# EAGLE board TGBD (EAGLE 9.6.2), part 1 of 2
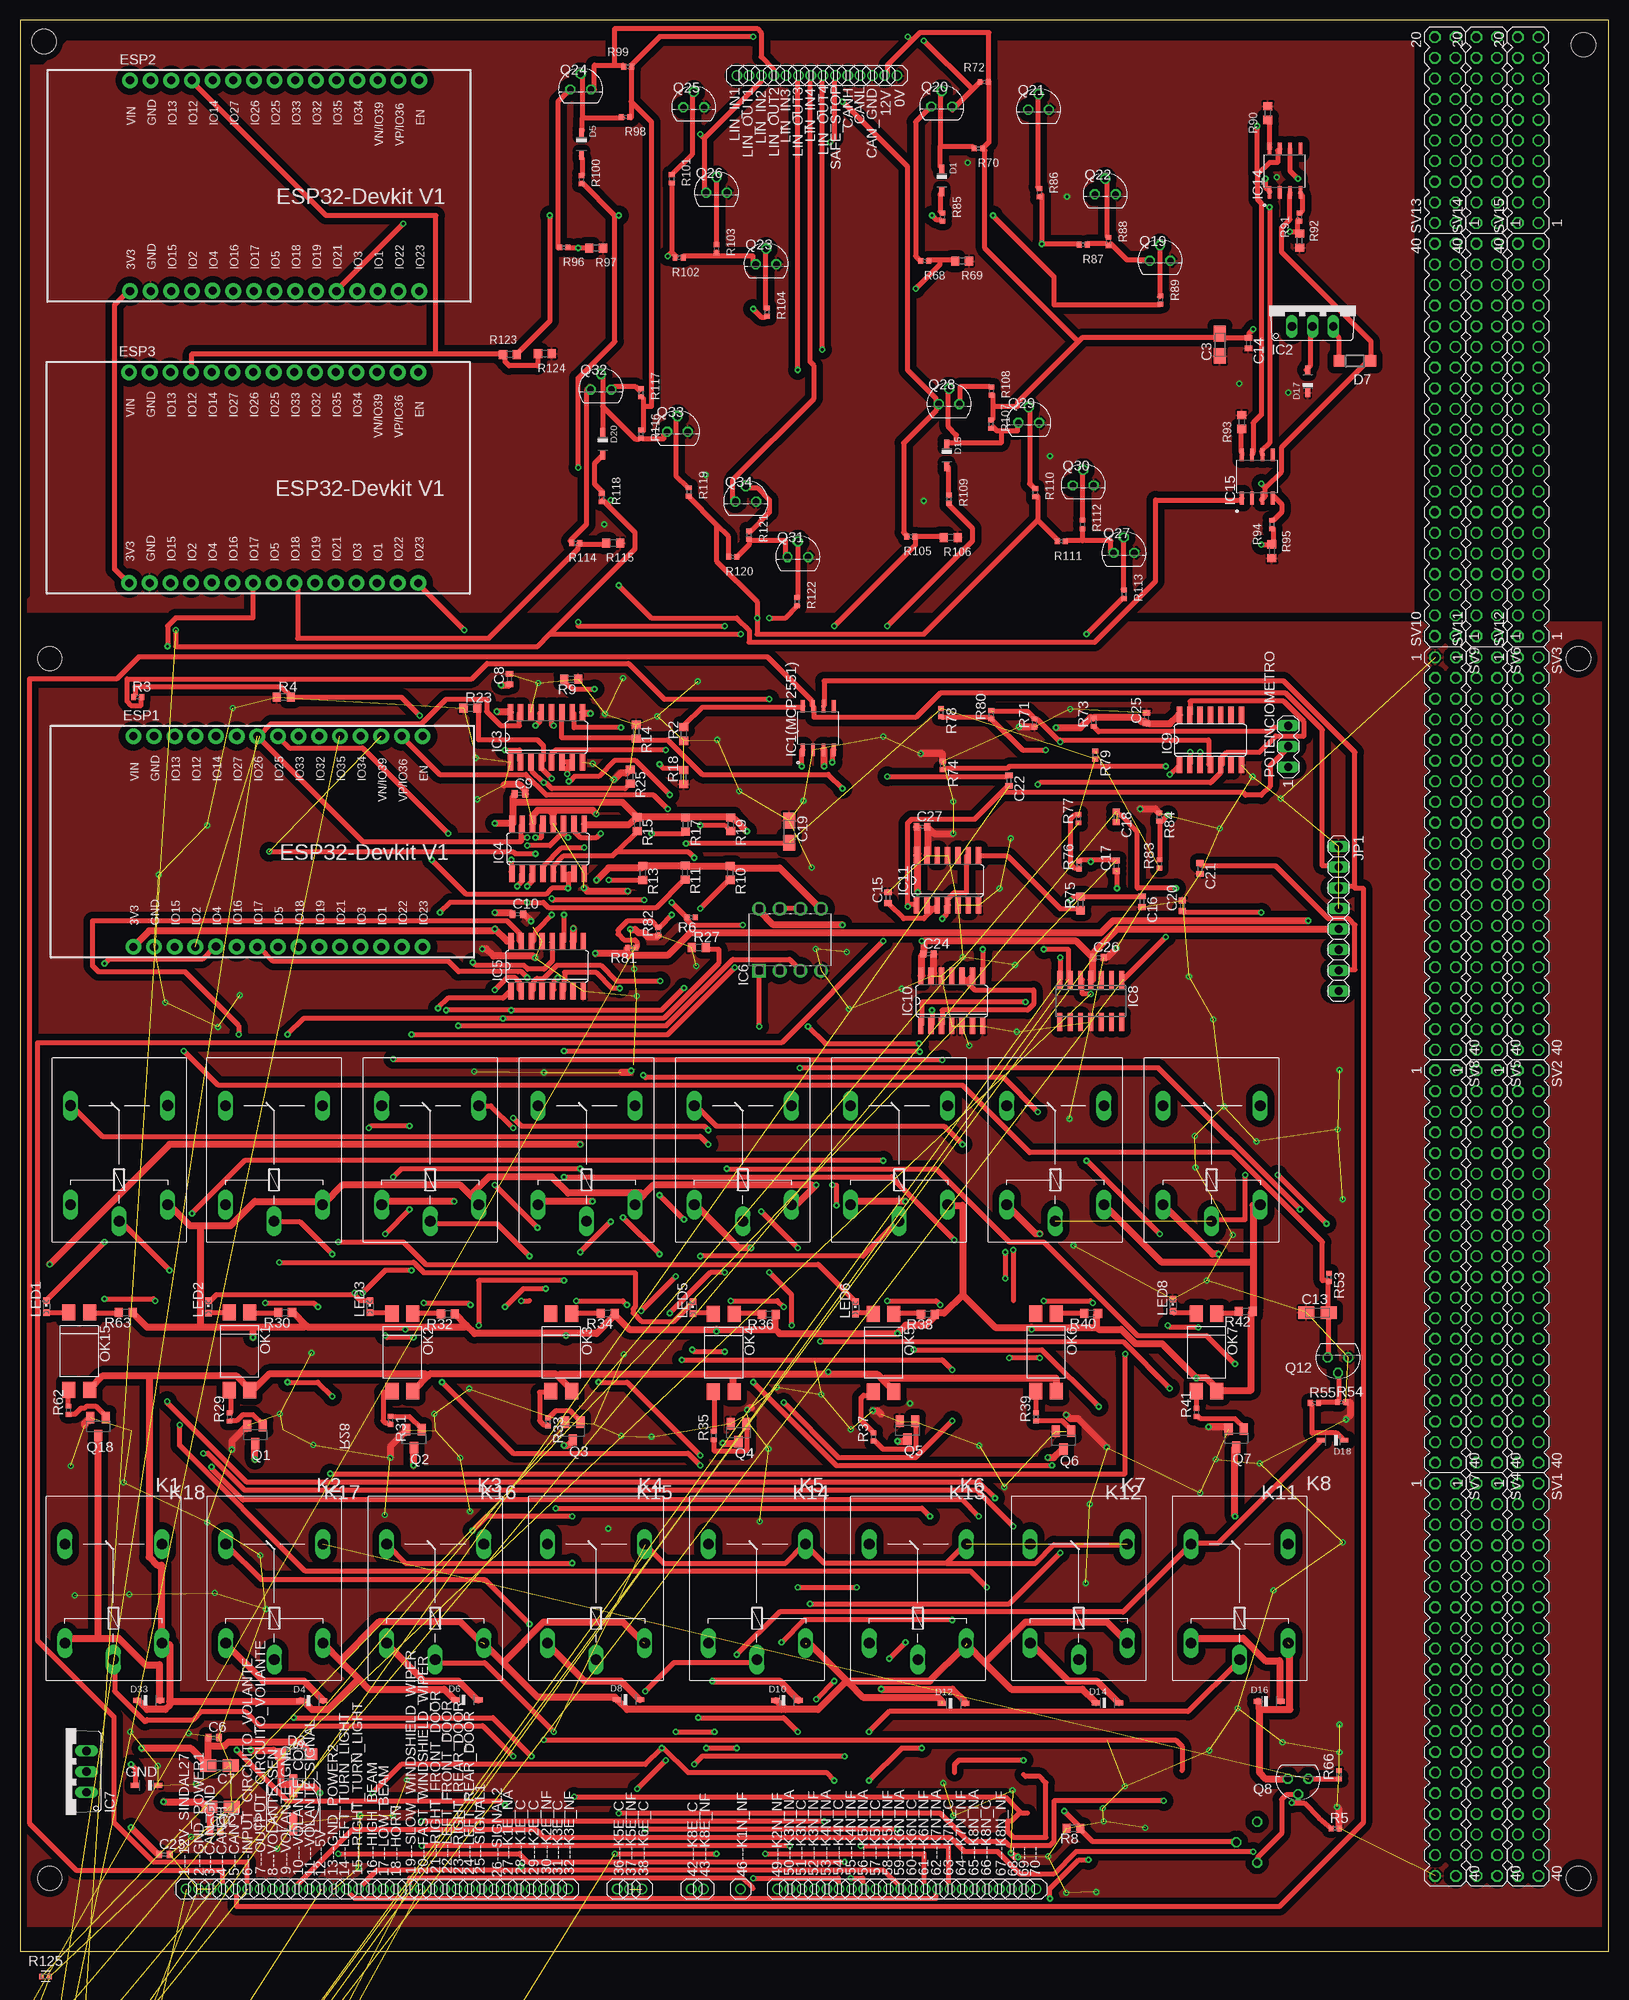
[diagram p5: board, top side]
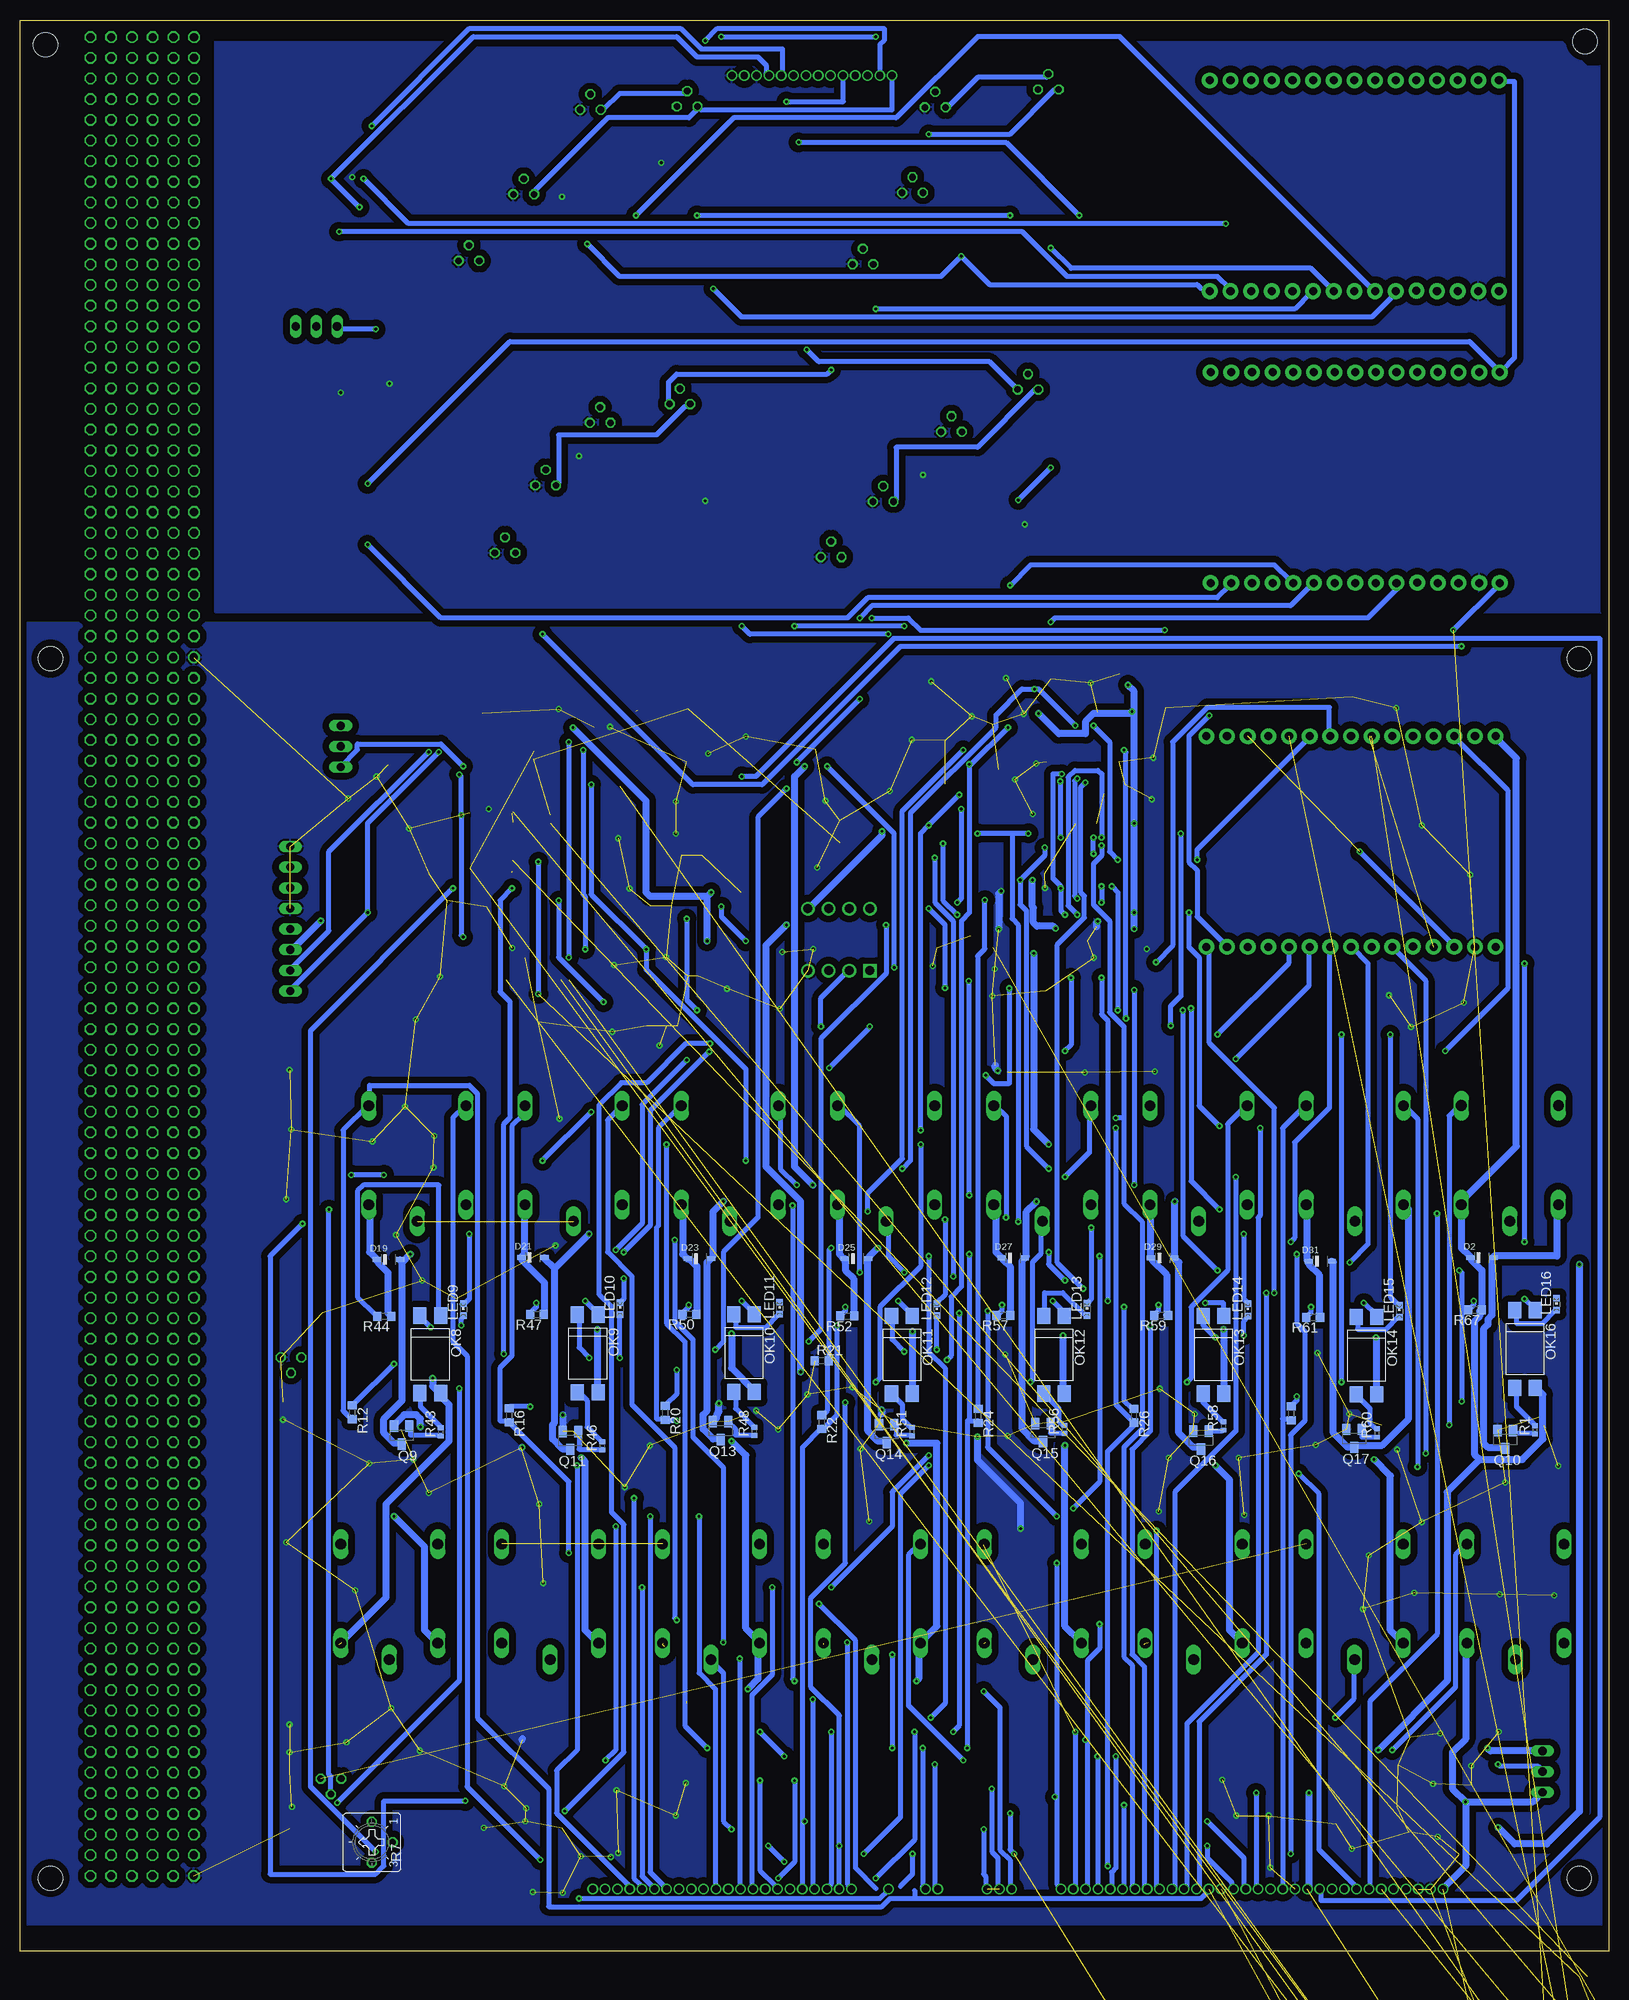
[diagram p6: board, bottom side, seen from below]

Size 195.3 x 237.5 mm. Coordinates in mm from the lower left corner, seen from the top.
Outline: 0,0 195.3,0 195.3,237.5 0,237.5 0,0
Copper layers (1*16): Top 0.035mm / dielectric 1.5mm / Bottom 0.035mm
Design rules "default *": minimum track width 24mil, minimum drill 0.35mm, track to track 6mil, track to pad 6mil, pad to pad 6mil, via to via 6mil, smd to smd 6mil, copper to edge 20mil, drill to drill 6mil, minimum pad ring 8mil, minimum via ring 8mil, stop-mask expansion 4mil, vias tented up to drill 0mil, thermal gap 10mil
Net classes: 1 Power: width 0.838 mm, clearance 0.152 mm
Holes 3 mm at 3.6,159 191.6,159 3.6,9 191.6,9 2.9,234.9 192.2,234.5

## Footprints (pad centres in the part's own frame; a part is rotated, then mirrored left to right if it is on the bottom)
1X01 = drill 0.9 pad 1.09: 1 0,0
C0402 = smd 0.7 x 0.9: 1 -0.65,0; 2 0.65,0
A/3216-18R = smd 1.95 x 1.5: + 1.375,0; - -1.375,0
UD-6,3X7,7_NICHICON = smd 2.8 x 1: + 2.35,0; - -2.35,0
C2.5-3 = drill 0.813 pad 1.6 octagon: 1 -1.27,0; 2 1.27,0
C2.5-2 = drill 0.813 pad 1.6 octagon: 1 -1.27,0; 2 1.27,0
SODFL2512X100N = smd 1.05 x 0.6: A 1.4,0; C -1.4,0
SOD123 = smd 1.4 x 1.4: A 1.9,0; C -1.9,0
DO35-7 = drill 0.813 long: A 3.81,0; C -3.81,0
HLMP6 = drill 0.813 long: A -1.27,0; K 1.27,0
ESP32-DEVKITV1 = drill 1 pad 1.93: 3V3 -16.52,-12.6; D1 13.96,-12.6; D2 -8.9,-12.6; D3 11.42,-12.6; D4 -6.36,-12.549; D5 1.26,-12.6; D12 -8.9,13.313; D13 -11.44,13.313; D14 -6.36,13.313; D15 -11.44,-12.6; D16 -3.82,-12.6; D17 -1.28,-12.6; D18 3.8,-12.6; D19 6.34,-12.6; D21 8.88,-12.6; D22 16.5,-12.6; D23 19.04,-12.6; D25 1.26,13.313; D26 -1.28,13.313; D27 -3.82,13.313; D32 6.34,13.313; D33 3.8,13.313; D34 11.42,13.313; D35 8.88,13.313; D36 16.5,13.313; D39 13.96,13.313; EN 19.04,13.313; GND@1 -13.98,13.313; GND@2 -13.98,-12.6; VIN -16.52,13.313
GSH15 = drill 1.321 pad 2.54 long: 1 -7.62,0; 2 7.62,0 | hole 2.794: 0,0
SOIC127P599X175-8N = smd 1.58 x 0.6: 1 -2.67,1.905; 2 -2.67,0.635; 3 -2.67,-0.635; 4 -2.67,-1.905; 5 2.67,-1.905; 6 2.67,-0.635; 7 2.67,0.635; 8 2.67,1.905
TO220V = drill 1.016 long: 1 -2.54,-2.54; 2 0,-2.54; 3 2.54,-2.54
SO16 = smd 0.66 x 2.032: 1 -4.445,-3.073; 2 -3.175,-3.073; 3 -1.905,-3.073; 4 -0.635,-3.073; 5 0.635,-3.073; 6 1.905,-3.073; 7 3.175,-3.073; 8 4.445,-3.073; 9 4.445,3.073; 10 3.175,3.073; 11 1.905,3.073; 12 0.635,3.073; 13 -0.635,3.073; 14 -1.905,3.073; 15 -3.175,3.073; 16 -4.445,3.073
DIP254P762X508-8 = drill 1.118 pad 1.676 square: 1 -7.62,7.62 | drill 1.118 pad 1.676: 2 -7.62,5.08; 3 -7.62,2.54; 4 -7.62,0; 5 0,0; 6 0,2.54; 7 0,5.08; 8 0,7.62
SO14 = smd 0.6 x 2.2: 1 -3.81,-2.6; 2 -2.54,-2.6; 3 -1.27,-2.6; 4 0,-2.6; 5 1.27,-2.6; 6 2.54,-2.6; 7 3.81,-2.6; 8 3.81,2.6; 9 2.54,2.6; 10 1.27,2.6; 11 0,2.6; 12 -1.27,2.6; 13 -2.54,2.6; 14 -3.81,2.6
SO14' = smd 0.66 x 2.032: 1 -3.81,-3.073; 2 -2.54,-3.073; 3 -1.27,-3.073; 4 0,-3.073; 5 1.27,-3.073; 6 2.54,-3.073; 7 3.81,-3.073; 8 3.81,3.073; 9 2.54,3.073; 10 1.27,3.073; 11 0,3.073; 12 -1.27,3.073; 13 -2.54,3.073; 14 -3.81,3.073
1X08 = drill 1.016 long: 1 -8.89,0; 2 -6.35,0; 3 -3.81,0; 4 -1.27,0; 5 1.27,0; 6 3.81,0; 7 6.35,0; 8 8.89,0
G5LE = drill 1.321 long: 1 -7.493,-5.969; 2 -7.493,5.969; O 4.699,5.969; P -9.525,0; S 4.699,-5.969
CHIPLED_0603 = smd 0.8 x 0.8: A 0,-0.75; C 0,0.75
DIL4-SMD = smd 1.6 x 2: 1 -1.27,-4.77; 2 1.27,-4.77; 3 1.27,4.77; 4 -1.27,4.77
MA03-1 = drill 1.016 long: 1 -2.54,0; 2 0,0; 3 2.54,0
SOT23 = smd 1 x 1.4: 1 -0.95,-1.1; 2 0.95,-1.1; 3 0,1.1
TO92 = drill 0.813 octagon: 1 1.27,0; 2 0,1.905; 3 -1.27,0
TO92260P520H933-3 = drill 0.91 pad 1.37 square: 1 -2.6,-1.113 | drill 0.91 pad 1.37: 2 0,-1.113; 3 2.6,-1.113
R0402 = smd 0.6 x 0.7: 1 -0.5,0; 2 0.5,0
R0603 = smd 1 x 1.1: 1 -0.85,0; 2 0.85,0
CT6 = drill 0.813 octagon: A 2.515,0; E -2.515,0; S 0,-2.54
RESC1005X40 = smd 0.535 x 0.644: 1 -0.507,0; 2 0.507,0
RESAD724W46L381D178B = drill 0.66 pad 1.26: 1 -3.62,0; 2 3.62,0
0204/7 = drill 0.813 octagon: 1 -3.81,0; 2 3.81,0
MA20-2 = drill 1.016 octagon: 1 -24.13,-1.27; 2 -24.13,1.27; 3 -21.59,-1.27; 4 -21.59,1.27; 5 -19.05,-1.27; 6 -19.05,1.27; 7 -16.51,-1.27; 8 -16.51,1.27; 9 -13.97,-1.27; 10 -13.97,1.27; 11 -11.43,-1.27; 12 -11.43,1.27; 13 -8.89,-1.27; 14 -8.89,1.27; 15 -6.35,-1.27; 16 -6.35,1.27; 17 -3.81,-1.27; 18 -3.81,1.27; 19 -1.27,-1.27; 20 -1.27,1.27; 21 1.27,-1.27; 22 1.27,1.27; 23 3.81,-1.27; 24 3.81,1.27; 25 6.35,-1.27; 26 6.35,1.27; 27 8.89,-1.27; 28 8.89,1.27; 29 11.43,-1.27; 30 11.43,1.27; 31 13.97,-1.27; 32 13.97,1.27; 33 16.51,-1.27; 34 16.51,1.27; 35 19.05,-1.27; 36 19.05,1.27; 37 21.59,-1.27; 38 21.59,1.27; 39 24.13,-1.27; 40 24.13,1.27
MA10-2 = drill 1.016 octagon: 1 -11.43,-1.27; 2 -11.43,1.27; 3 -8.89,-1.27; 4 -8.89,1.27; 5 -6.35,-1.27; 6 -6.35,1.27; 7 -3.81,-1.27; 8 -3.81,1.27; 9 -1.27,-1.27; 10 -1.27,1.27; 11 1.27,-1.27; 12 1.27,1.27; 13 3.81,-1.27; 14 3.81,1.27; 15 6.35,-1.27; 16 6.35,1.27; 17 8.89,-1.27; 18 8.89,1.27; 19 11.43,-1.27; 20 11.43,1.27
TO220 = drill 1.118 long: 1 -2.54,-6.35; 2 0,-6.35; 3 2.54,-6.35 | hole 3.302: 0,11.176
DIP254P762X420-14 = drill 1.118 square: 1 -7.62,15.24 | drill 1.118: 2 -7.62,12.7; 3 -7.62,10.16; 4 -7.62,7.62; 5 -7.62,5.08; 6 -7.62,2.54; 7 -7.62,0; 8 0,0; 9 0,2.54; 10 0,5.08; 11 0,7.62; 12 0,10.16; 13 0,12.7; 14 0,15.24

## Placement (x,y rotation side)
0V  [1X01]  107.79,230.7 0 top
1---12V_SINDAL27  [1X01]  20.38,7.65 0 top
2---GND_POWER1  [1X01]  21.89,7.65 0 top
3---CAN_GND  [1X01]  23.41,7.65 0 top
4---CAN_H  [1X01]  24.92,7.65 0 top
5---CAN_L  [1X01]  26.44,7.65 0 top
6---INPUT_CIRCUITO_VOLANTE  [1X01]  27.95,7.65 0 top
7---OUTPUT_CIRCUITO_VOLANTE  [1X01]  29.47,7.65 0 top
8---VOLANTE_SEN  1  [1X01]  30.98,7.65 0 top
9---VOLANTE_GND  2  [1X01]  32.5,7.65 0 top
10---VOLANTE_COS  3  [1X01]  34.01,7.65 0 top
11---VOLANTE_SIGNAL  5  [1X01]  35.53,7.65 0 top
12---5V  [1X01]  37.04,7.65 0 top
12V  [1X01]  106.28,230.7 0 top
13---GND_POWER2  [1X01]  38.56,7.65 0 top
14---LEFT_TURN_LIGHT  [1X01]  40.07,7.65 0 top
15---RIGHT_TURN_LIGHT  [1X01]  41.59,7.65 0 top
16---HIGH_BEAM  [1X01]  43.1,7.65 0 top
17---LOW_BEAM  [1X01]  44.62,7.65 0 top
18---HORN  [1X01]  46.13,7.65 0 top
19---SLOW_WINDSHIELD_WIPER  [1X01]  47.65,7.65 0 top
20---FAST_WINDSHIELD_WIPER  [1X01]  49.16,7.65 0 top
21---RIGHT_FRONT_DOOR  [1X01]  50.68,7.65 0 top
22---LEFT_FRONT_DOOR  [1X01]  52.19,7.65 0 top
23---RIGHT_REAR_DOOR  [1X01]  53.71,7.65 0 top
24---LEFT_REAR_DOOR  [1X01]  55.22,7.65 0 top
25---SIGNAL1  [1X01]  56.74,7.65 0 top
26---SIGNAL2  [1X01]  58.25,7.65 0 top
27---K1E_NA  [1X01]  59.77,7.65 0 top
28---K1E_C  [1X01]  61.28,7.65 0 top
29---K2E_C  [1X01]  62.8,7.65 0 top
30---K2E_NF  [1X01]  64.31,7.65 0 top
31---K3E_C  [1X01]  65.83,7.65 0 top
32---K3E_NF  [1X01]  67.34,7.65 0 top
36---K5E_C  [1X01]  73.4,7.65 0 top
37---K5E_NF  [1X01]  74.92,7.65 0 top
38---K6E_C  [1X01]  76.43,7.65 0 top
42---K8E_C  [1X01]  82.49,7.65 0 top
43---K8E_NF  [1X01]  84.01,7.65 0 top
46---K1N_NF  [1X01]  88.55,7.65 0 top
49---K2N_NF  [1X01]  93.1,7.65 0 top
50---K3N_NA  [1X01]  94.61,7.65 0 top
51---K3N_C  [1X01]  96.13,7.65 0 top
52---K3N_NF  [1X01]  97.64,7.65 0 top
53---K4N_NA  [1X01]  99.16,7.65 0 top
54---K4N_C  [1X01]  100.67,7.65 0 top
55---K4N_NF  [1X01]  102.19,7.65 0 top
56---K5N_NA  [1X01]  103.7,7.65 0 top
57---K5N_C  [1X01]  105.22,7.65 0 top
58---K5N_NF  [1X01]  106.73,7.65 0 top
59---K6N_NA  [1X01]  108.25,7.65 0 top
60---K6N_C  [1X01]  109.76,7.65 0 top
61---K6N_NF  [1X01]  111.28,7.65 0 top
62---K7N_NA  [1X01]  112.79,7.65 0 top
63---K7N_C  [1X01]  114.31,7.65 0 top
64---K7N_NF  [1X01]  115.82,7.65 0 top
65---K8N_NA  [1X01]  117.34,7.65 0 top
66---K8N_C  [1X01]  118.85,7.65 0 top
67---K8N_NF  [1X01]  120.37,7.65 0 top
68---  [1X01]  121.88,7.65 0 top
69---  [1X01]  123.39,7.65 0 top
70---  [1X01]  124.91,7.65 0 top
C1  100n  [C0402]  23.94,14.7 0 top
C2  10u  [A/3216-18R]  24.64,17.77 180 top
C3  10u  [A/3216-18R]  147.5,197.6 90 top
C4  10u  [C0402]  0.8,-8.6 0 top  (outside the outline)
C5  100u  [UD-6,3X7,7_NICHICON]  33.57,18.01 90 top
C6  100n  [C0402]  23.77,26.31 0 top
C7  10u  [A/3216-18R]  24.49,22.86 180 top
C8  100n  [C0402]  60.14,156.47 90 top
C9  100n  [C0402]  61.44,142.35 0 top
C10  100n  [C0402]  61.18,127.57 0 top
C11  2K2  [C2.5-3]  -39.6,-125.4 0 top  (outside the outline)
C12  2K2  [C2.5-3]  -39.6,-148.1 0 top  (outside the outline)
C13  1uF  [A/3216-18R]  159.51,78.56 0 top
C14  100n  [C0402]  151,197.8 270 top
C15  10n  [C0402]  106.68,129.59 90 top
C16  10n  [C0402]  137.92,129.1 270 top
C17  100n  [C0402]  134.76,133.52 90 top
C18  100n  [C0402]  134.75,139.54 270 top
C19  10u  [A/3216-18R]  94.54,137.72 270 top
C20  3,9n  [C0402]  142.88,128.6 90 top
C21  3,9n  [C0402]  145.07,133.2 270 top
C22  100n  [C0402]  121.57,143.99 270 top
C23  100n  [C0402]  17.72,11.91 0 top
C24  100n  [C0402]  111.67,122.66 0 top
C25  100n  [C0402]  138.49,151.67 90 top
C26  100n  [C0402]  132.57,122.24 0 top
C27  100n  [C0402]  110.86,138.31 0 top
C28  10u  [C0402]  0.8,-13.5 0 top  (outside the outline)
C29  10u  [C0402]  0.8,-30.7 0 top  (outside the outline)
C30  100uF  [C2.5-2]  -14.1,-97.8 0 top  (outside the outline)
CAN_GND  [1X01]  104.77,230.7 0 top
CANH  [1X01]  101.73,230.7 0 top
CANL  [1X01]  103.25,230.7 0 top
D1  1N4148WS  [SODFL2512X100N]  113.3,217.8 270 top
D2  1N4148WS  [SODFL2512X100N]  15.58,85.31 0 bottom
D3  1N4007  [SOD123]  33.93,24.28 0 top
D4  1N4148WS  [SODFL2512X100N]  35.83,30.84 0 top
D5  1N4148WS  [SODFL2512X100N]  69,222.3 270 top
D6  1N4148WS  [SODFL2512X100N]  54.92,30.92 0 top
D7  [SOD123]  164.1,195.6 180 top
D8  1N4148WS  [SODFL2512X100N]  74.8,30.97 0 top
D9  1N4148DO35-7  [DO35-7]  -3.4,-73.5 0 top  (outside the outline)
D10  1N4148WS  [SODFL2512X100N]  94.28,30.87 0 top
D11  1N4148DO35-7  [DO35-7]  -3.4,-79.8 0 top  (outside the outline)
D12  1N4148WS  [SODFL2512X100N]  114.76,30.52 0 top
D13  HLMP6  [HLMP6]  -38.3,-153.7 0 top  (outside the outline)
D14  1N4148WS  [SODFL2512X100N]  133.69,30.57 0 top
D15  1N4148WS  [SODFL2512X100N]  113.9,184 270 top
D16  1N4148WS  [SODFL2512X100N]  153.57,30.77 0 top
D17  1N4148WS  [SODFL2512X100N]  158.3,193.1 90 top
D18  1N4148WS  [SODFL2512X100N]  161.36,62.88 180 top
D19  1N4148WS  [SODFL2512X100N]  150.04,85.09 0 bottom
D20  1N4148WS  [SODFL2512X100N]  71.6,185.4 270 top
D21  1N4148WS  [SODFL2512X100N]  132.26,85.34 0 bottom
D22  HLMP6  [HLMP6]  -38.3,-157.6 0 top  (outside the outline)
D23  1N4148WS  [SODFL2512X100N]  111.78,85.19 0 bottom
D25  1N4148WS  [SODFL2512X100N]  92.5,85.19 0 bottom
D27  1N4148WS  [SODFL2512X100N]  73.22,85.29 0 bottom
D29  1N4148WS  [SODFL2512X100N]  54.84,85.29 0 bottom
D31  1N4148WS  [SODFL2512X100N]  35.46,84.89 0 bottom
D33  1N4148WS  [SODFL2512X100N]  15.79,30.87 0 top
ESP1  ESP32DEVKITV1  [ESP32-DEVKITV1]  30.42,136.14 0 top
ESP2  ESP32DEVKITV1  [ESP32-DEVKITV1]  30,216.8 0 top
ESP3  ESP32DEVKITV1  [ESP32-DEVKITV1]  29.9,180.9 0 top
F1  5A  [GSH15]  -29.4,-165.7 0 top  (outside the outline)
GND  1N4148WS  [SODFL2512X100N]  15.52,20.41 180 top
IC1(MCP2551)  MCP2551-I/SN  [SOIC127P599X175-8N]  98.12,150.47 90 top
IC2  7805TV  [TO220V]  158.9,202.4 0 top
IC3  74HC166D  [SO16]  64.69,149.34 0 top
IC4  74HC166D  [SO16]  64.89,135.62 0 top
IC5  74HC595D  [SO16]  64.77,121.17 0 top
IC6  LM6142BIN  [DIP254P762X508-8]  98.46,128.24 90 top
IC7  7805TV  [TO220V]  5.6,22.1 90 top
IC8  LM324D  [SO14]  131.63,116.9 180 top
IC9  4016D  [SO14']  146.33,148.98 0 top
IC10  74HC08D  [SO14']  114.53,116.89 0 top
IC11  74HC04D  [SO14']  114.02,131.71 0 top
IC12  LM324D  [SO14]  5.7,-38.6 0 top  (outside the outline)
IC13  LM324D  [SO14]  5.7,-47.9 0 top  (outside the outline)
IC14  MCP2551-I/SN  [SOIC127P599X175-8N]  155.5,219 90 top
IC15  MCP2551-I/SN  [SOIC127P599X175-8N]  152.1,181.4 90 top
IC16  LM324D  [SO14]  5.7,-57.2 0 top  (outside the outline)
IC17  LM324D  [SO14]  5.7,-66.5 0 top  (outside the outline)
JP1  [1X08]  162.1,127 270 top
K1  G5LE  [G5LE]  11.45,45.4 90 top
K2  G5LE  [G5LE]  31.23,45.4 90 top
K3  G5LE  [G5LE]  51.02,45.4 90 top
K4  G5LE  [G5LE]  70.8,45.4 90 top
K5  G5LE  [G5LE]  90.58,45.4 90 top
K6  G5LE  [G5LE]  110.36,45.4 90 top
K7  G5LE  [G5LE]  130.15,45.4 90 top
K8  G5LE  [G5LE]  149.93,45.4 90 top
K11  G5LE  [G5LE]  146.48,99.32 90 top
K12  G5LE  [G5LE]  127.27,99.32 90 top
K13  G5LE  [G5LE]  108.05,99.32 90 top
K14  G5LE  [G5LE]  88.84,99.32 90 top
K15  G5LE  [G5LE]  69.63,99.32 90 top
K16  G5LE  [G5LE]  50.41,99.32 90 top
K17  G5LE  [G5LE]  31.2,99.32 90 top
K18  G5LE  [G5LE]  12.15,99.33 90 top
LED1  [CHIPLED_0603]  3.19,79.3 0 top
LED2  [CHIPLED_0603]  23.13,79.25 0 top
LED3  [CHIPLED_0603]  42.97,79.3 0 top
LED5  [CHIPLED_0603]  82.7,79.15 0 top
LED6  [CHIPLED_0603]  102.69,79.13 0 top
LED8  [CHIPLED_0603]  141.71,79.47 0 top
LED9  [CHIPLED_0603]  140.83,78.92 0 bottom
LED10  [CHIPLED_0603]  121.56,79.06 0 bottom
LED11  [CHIPLED_0603]  101.93,79.1 0 bottom
LED12  [CHIPLED_0603]  82.6,78.91 0 bottom
LED13  [CHIPLED_0603]  64.14,78.96 0 bottom
LED14  [CHIPLED_0603]  44.35,78.9 0 bottom
LED15  [CHIPLED_0603]  25.74,78.75 0 bottom
LED16  [CHIPLED_0603]  6.41,79.59 0 bottom
LIN_IN1  [1X01]  88.1,230.7 0 top
LIN_IN2  [1X01]  91.13,230.7 0 top
LIN_IN3  [1X01]  94.16,230.7 0 top
LIN_IN4  [1X01]  97.19,230.7 0 top
LIN_OUT1  [1X01]  89.61,230.7 0 top
LIN_OUT2  [1X01]  92.64,230.7 0 top
LIN_OUT3  [1X01]  95.67,230.7 0 top
LIN_OUT4  [1X01]  98.7,230.7 0 top
OK1  LTV816S  [DIL4-SMD]  26.93,73.8 180 top
OK2  LTV816S  [DIL4-SMD]  46.97,73.67 180 top
OK3  LTV816S  [DIL4-SMD]  66.51,73.67 180 top
OK4  LTV816S  [DIL4-SMD]  86.5,73.62 180 top
OK5  LTV816S  [DIL4-SMD]  106.14,73.62 180 top
OK6  LTV816S  [DIL4-SMD]  126.13,73.67 180 top
OK7  LTV816S  [DIL4-SMD]  145.87,73.67 180 top
OK8  LTV816S  [DIL4-SMD]  144.89,73.42 180 bottom
OK9  LTV816S  [DIL4-SMD]  125.53,73.52 180 bottom
OK10  LTV816S  [DIL4-SMD]  106.32,73.57 180 bottom
OK11  LTV816S  [DIL4-SMD]  86.91,73.37 180 bottom
OK12  LTV816S  [DIL4-SMD]  68.2,73.37 180 bottom
OK13  LTV816S  [DIL4-SMD]  48.59,73.37 180 bottom
OK14  LTV816S  [DIL4-SMD]  29.78,73.27 180 bottom
OK15  LTV816S  [DIL4-SMD]  7.24,73.82 180 top
OK16  LTV816S  [DIL4-SMD]  10.3,74.08 180 bottom
POTENCIOMETRO  10k  [MA03-1]  155.9,148.2 90 top
Q1  [SOT23]  28.87,63.56 180 top
Q2  [SOT23]  48.4,63.06 180 top
Q3  [SOT23]  67.93,64.01 180 top
Q4  [SOT23]  88.31,63.81 180 top
Q5  [SOT23]  109.09,64.11 180 top
Q6  [SOT23]  128.27,62.86 180 top
Q7  [SOT23]  149.5,63.11 180 top
Q8  BC548  [TO92]  157.11,21.24 180 top
Q9  [SOT23]  148.41,63.49 180 bottom
Q10  [SOT23]  12.71,62.96 180 bottom
Q11  [SOT23]  127.67,62.84 180 bottom
Q12  BC548  [TO92]  162.02,73.05 180 top
Q13  [SOT23]  109.19,64.04 180 bottom
Q14  [SOT23]  88.77,63.69 180 bottom
Q15  [SOT23]  69.55,63.79 180 bottom
Q16  [SOT23]  50.13,62.89 180 bottom
Q17  [SOT23]  31.3,63.09 180 bottom
Q18  [SOT23]  9.56,64.56 180 top
Q19  [TO92]  140.14,207.93 0 top
Q20  [TO92]  113.3,226.9 0 top
Q21  [TO92]  125.2,226.5 0 top
Q22  [TO92]  133.4,216.1 0 top
Q23  [TO92]  91.7,207.5 0 top
Q24  [TO92]  68.9,229 0 top
Q25  [TO92]  82.8,226.8 0 top
Q26  [TO92]  85.6,216.3 0 top
Q27  [TO92]  135.7,172 0 top
Q28  [TO92]  114.2,190.3 0 top
Q29  [TO92]  124,188 0 top
Q30  [TO92]  130.7,180.3 0 top
Q31  [TO92]  95.6,171.5 0 top
Q32  [TO92]  71.4,192.1 0 top
Q33  [TO92]  80.8,186.9 0 top
Q34  [TO92]  89.2,178.3 0 top
Q35  BC558  [TO92260P520H933-3]  -4.4,-65.4 0 top  (outside the outline)
R1  1k  [R0402]  9.05,64.14 90 bottom
R2  10K  [R0603]  81.58,149.74 90 top
R3  3.3k  [R0402]  14.42,154.26 0 top
R4  5.6k  [R0603]  32.39,154.25 0 top
R5  1K  [R0402]  161.67,15.12 0 top
R6  1K  [R0402]  82.49,127.19 180 top
R7  10K  [CT6]  152.07,13.42 90 bottom
R8  5.6k  [R0603]  129.5,15.12 180 top
R9  890  [R0603]  67.73,156.46 180 top
R10  5.6K  [R0603]  87.31,132.64 270 top
R11  5.6K  [R0603]  81.73,132.69 270 top
R12  5.6K  [R0603]  154.47,66.31 270 bottom
R13  5.6K  [R0603]  76.54,132.62 270 top
R14  890  [R0603]  75.74,150.01 270 top
R15  5.6K  [R0603]  75.87,138.63 270 top
R16  5.6K  [R0603]  135.18,65.92 270 bottom
R17  5.6K  [R0603]  81.79,138.59 270 top
R18  890  [R0603]  81.55,144.44 90 top
R19  5.6K  [R0603]  87.34,138.62 270 top
R20  5.6K  [R0603]  116,66.22 270 bottom
R21  890  [R0603]  96.76,72.64 0 bottom
R22  5.6K  [R0603]  96.76,65.1 270 bottom
R23  890  [R0603]  55.35,152.92 0 top
R24  5.6k  [R0603]  77.52,65.86 270 bottom
R25  890  [R0603]  74.99,144.49 270 top
R26  5.6k  [R0603]  58.36,65.87 270 bottom
R27  890  [R0603]  83.41,123.46 0 top
R28  5.6k  [R0603]  39.03,66.16 270 bottom
R29  1k  [R0402]  25.72,65.71 90 top
R30  133  [R0603]  32.56,78.56 180 top
R31  1k  [R0402]  45.53,65.3 270 top
R32  133  [R0603]  52.57,78.41 180 top
R33  1k  [R0402]  64.88,65.11 270 top
R34  133  [R0603]  72.23,78.46 180 top
R35  1k  [R0402]  85.27,63.43 90 top
R36  133  [R0603]  92.04,78.36 180 top
R37  1k  [R0402]  104.92,63.27 90 top
R38  133  [R0603]  111.6,78.36 180 top
R39  1k  [R0402]  124.87,65.74 90 top
R40  133  [R0603]  131.66,78.46 180 top
R41  1k  [R0402]  144.62,66.28 90 top
R42  133  [R0603]  150.67,78.71 180 top
R43  1k  [R0402]  143.6,63.87 90 bottom
R44  133  [R0603]  150.56,78.11 180 bottom
R46  1k  [R0402]  123.75,62.16 90 bottom
R47  133  [R0603]  131.77,78.31 180 bottom
R48  1k  [R0402]  105.05,63.95 90 bottom
R50  133  [R0603]  113.03,78.36 180 bottom
R51  1k  [R0402]  85.67,63.92 90 bottom
R52  133  [R0603]  93.61,78.13 180 bottom
R53  100k  [R0402]  160.91,82.9 270 top
R54  100k  [R0402]  162.46,67.55 0 top
R55  100k  [R0402]  159.13,67.45 0 top
R56  1k  [R0402]  66.92,64.21 90 bottom
R57  133  [R0603]  74.42,78.23 180 bottom
R58  1k  [R0402]  47.37,64.6 90 bottom
R59  133  [R0603]  55.03,78.23 180 bottom
R60  1k  [R0402]  28.47,63.74 90 bottom
R61  133  [R0603]  36.34,77.98 180 bottom
R62  1k  [R0402]  5.94,66.55 90 top
R63  133  [R0603]  12.97,78.58 180 top
R66  1k  [R0402]  162.15,21.73 90 top
R67  133  [R0603]  16.43,78.88 180 bottom
R68  33k  [R0402]  111.2,207.9 180 top
R69  12k  [R0603]  115.8,207.9 180 top
R70  33k  [R0402]  117.81,221.74 180 top
R71  1k  [R0402]  124.71,151.09 90 top
R72  33k  [R0402]  118.5,229.9 0 top
R73  1k  [R0402]  131.98,151.17 90 top
R74  1k  [R0402]  113.43,145.83 270 top
R75  100  [R0603]  130.36,128.9 90 top
R76  33k  [R0402]  130.16,133.62 90 top
R77  33k  [R0402]  130.13,139.3 90 top
R78  33k  [R0402]  113.22,152.36 270 top
R79  33k  [R0402]  132.17,147.14 270 top
R80  33k  [R0402]  119.39,152.09 90 top
R81  1k  [R0402]  75.19,123.44 180 top
R82  1k  [R0402]  78.45,125.44 90 top
R83  33k  [R0402]  140.06,133.75 90 top
R84  1k  [R0402]  140.04,139.53 270 top
R85  1k  [R0402]  113.4,213.3 270 top
R86  4k7  [R0402]  125.3,216.3 270 top
R87  4k7  [R0402]  130.7,209.9 180 top
R88  4k7  [R0402]  133.8,210.3 270 top
R89  4k7  [R0402]  140.2,203.1 270 top
R90  10k  [R0603]  153.4,226.1 90 top
R91  3k3  [R0402]  157.3,213.3 90 top
R92  5k6  [R0603]  157.3,210.4 270 top
R93  10k  [R0603]  150.2,188.1 90 top
R94  3k3  [R0402]  153.9,175.5 90 top
R95  5k6  [R0603]  153.9,172.2 270 top
R96  33k  [R0402]  66.81,209.56 180 top
R97  12k  [R0603]  70.8,209.5 180 top
R98  33k  [R0402]  74.4,225.6 180 top
R99  33k  [R0402]  74.7,231.8 0 top
R100  1k  [R0402]  69,217.9 270 top
R101  4k7  [R0402]  80.1,218 270 top
R102  4k7  [R0402]  81,208.3 180 top
R103  4k7  [R0402]  85.6,209.4 270 top
R104  4k7  [R0402]  91.8,201.6 270 top
R105  33k  [R0402]  109.5,174 180 top
R106  12k  [R0603]  114.4,173.9 180 top
R107  33k  [R0402]  119.36,187.81 270 top
R108  33k  [R0402]  119.4,191.9 270 top
R109  1k  [R0402]  114.2,178.6 270 top
R110  4k7  [R0402]  124.8,179.4 270 top
R111  4k7  [R0402]  128,173.4 180 top
R112  4k7  [R0402]  130.6,175.5 270 top
R113  4k7  [R0402]  135.7,166.9 270 top
R114  33k  [R0402]  68.3,173.2 180 top
R115  12k  [R0603]  72.9,173.2 180 top
R116  33k  [R0402]  76.3,186.6 270 top
R117  33k  [R0402]  76.3,191.7 270 top
R118  1k  [R0402]  71.5,178.8 270 top
R119  4k7  [R0402]  82.2,179.5 270 top
R120  4k7  [R0402]  87.6,171.5 180 top
R121  4k7  [R0402]  89.6,174.2 270 top
R122  4k7  [R0402]  95.5,166 270 top
R123  56k  [R0603]  60.2,196.4 0 top
R124  9k1  [R0603]  64.5,196.5 180 top
R125  100  [RESC1005X40]  3.1,-3.1 0 top  (outside the outline)
R126  100  [RESC1005X40]  1.9,-19.1 0 top  (outside the outline)
R127  100  [RESC1005X40]  1.9,-25.2 0 top  (outside the outline)
R128  1k  [RESAD724W46L381D178B]  -4.3,-86.5 0 top  (outside the outline)
R129  47Ω 5W  [RESAD724W46L381D178B]  -12.2,-91.1 0 top  (outside the outline)
R130  3.3K  [RESAD724W46L381D178B]  -12.2,-104.6 0 top  (outside the outline)
R131  5.6K  [RESAD724W46L381D178B]  -12.2,-109.2 0 top  (outside the outline)
R132  3.3K  [RESAD724W46L381D178B]  -12.2,-113.8 0 top  (outside the outline)
R133  5.6K  [RESAD724W46L381D178B]  -12.2,-118.4 0 top  (outside the outline)
R134  3K5  [0204/7]  -37.5,-131.7 0 top  (outside the outline)
R135  270  [0204/7]  -37.5,-135.6 0 top  (outside the outline)
R136  270  [0204/7]  -37.5,-139.5 0 top  (outside the outline)
R137  3K5  [0204/7]  -37.5,-143.4 0 top  (outside the outline)
SAFE_STOP  [1X01]  100.22,230.7 0 top
SV1  [MA20-2]  185.4,33.42 270 top
SV2  [MA20-2]  185.4,84.22 270 top
SV3  [MA20-2]  185.4,135.02 270 top
SV4  [MA20-2]  180.32,33.42 270 top
SV5  [MA20-2]  180.32,84.22 270 top
SV6  [MA20-2]  180.32,135.02 270 top
SV7  [MA20-2]  175.24,33.42 270 top
SV8  [MA20-2]  175.24,84.22 270 top
SV9  [MA20-2]  175.24,135.02 270 top
SV10  [MA20-2]  175.2,185.9 90 top
SV11  [MA20-2]  180.3,185.9 90 top
SV12  [MA20-2]  185.4,185.9 90 top
SV13  [MA10-2]  175.2,224 90 top
SV14  [MA10-2]  180.3,224 90 top
SV15  [MA10-2]  185.4,224 90 top
T3  TIP31C  [TO220]  -22.9,-113.6 0 top  (outside the outline)
U1  74HC14N,652  [DIP254P762X420-14]  -32.9,-116.6 0 top  (outside the outline)

## Tracks (layer width: path | path; a pad name or v marks a point on that pad's centre or on a via)
0V  (via drill 0.35)
  other vias: 84.3,181.6 71.8,175.5 126.6,183.9 111.1,178.4 128.7,215.8 116.5,220 154.5,218.2 149.9,192.8 155.9,191.7
  pour Top (isolate 0.813): -0.7,164.7 171.4,164.7 171.4,234.9 5.7,234.9 3.1,232.3 2.8,232 1.2,232 1.2,166.6
  pour Bottom (isolate 0.813): 1,164.6 171.3,164.6 171.4,164.7 171.4,234.9 5.7,234.9 2.7,231.9 1.2,231.9 1.1,232 1.1,164.7
3V3_ODRIVE  (via drill 0.35)
  Top 0.838: 74.6,122.7 74.6,122.5 79.6,122.5 82.35,125.25 132.85,125.25 134.35,126.75 v158.35,126.75 | 74.6,122.7 74.6,123.25 R81.2 | v13.6,15.25 16.85,12 C23.1 | v3.6,84.5 18.35,99.25 v68.85,99.25 | v70.7,122.75 70.75,122.7 74.6,122.7
  Bottom 0.838: v158.35,126.75 162.1,123 JP1.6 | v3.6,84.5 3.6,17.2 7.6,13.2 11.55,13.2 v13.6,15.25 | v68.85,99.25 70.7,101.1 v70.7,122.75
5V_ODRIVE  (via drill 0.35)
  Top 0.838: IC9.14 142.35,152 141.35,151 138.85,151 C25.1 138.35,151.25 137.85,151.25 137.35,151.75 132.1,151.75 R73.2 131.6,151.75 130.35,150.5 v127.35,150.5 | C27.1 110.35,138.25 110.35,135 IC11.14 110.35,134.5 v110.35,130.25 | IC10.14 110.85,120 110.85,122.5 C24.1 111.1,123 111.1,124.25 | IC8.4 131.85,119.5 131.85,122 C26.1 131.6,122.5 | 111.1,124.25 129.85,124.25 131.6,122.5 | 131.6,122.5 134.85,125.75 162.1,125.75 JP1.5 | v110.85,124.25 111.1,124.25
  Bottom 0.838: 110.85,129.75 v110.35,130.25 | v110.85,124.25 110.85,129.75 | v127.35,150.5 118.35,141.5 118.35,130.25 117.85,129.75 110.85,129.75
+3V3  (via drill 0.35)
  Top 0.838: v68,125.8 68,124.25 IC5.10 | v70.85,131.75 72.35,133.25 76.35,133.25 R13.1 76.6,133.5 81.6,133.5 R11.1 82.1,133.5 87.1,133.5 R10.1 87.6,133.25 93.35,133.25 98.35,128.25 IC6.5 | 60.6,141.3 60.6,138.75 IC4.16 60.1,138.75 v58.35,138.75 | 60.6,141.3 60.6,141.93 C9.1 | R15.1 76.1,139.5 81.6,139.5 R17.1 81.85,139.5 87.1,139.5 R19.1 87.6,139.25 87.85,139.25 v89.35,137.75 | IC4.9 69.48,138.55 74.78,138.55 R15.1 | 60.6,141.3 74.05,141.3 R15.1 | v58.35,127.75 60.35,127.75 C10.1 | IC5.16 60.1,124.25 59.85,124.25 v58.35,125.75 58.1,125.5 15.85,125.5 14.1,123.75 ESP1.3V3 | v59.1,155.75 60.1,155.75 C8.1 | v58.6,152.5 60.1,152.5 IC3.16 | v70.1,152.25 69.35,152.25 IC3.9
  Bottom 0.838: v58.35,125.75 v58.35,127.75 v58.35,138.75 58.35,152.5 | v59.1,155.75 58.35,155 58.35,152.5 | 58.35,152.5 v58.6,152.5 58.85,152.25 63.35,152.25 64.35,151.25 64.35,149.75 67.6,149.75 v70.1,152.25 | v89.35,137.75 89.35,137.25 98.35,128.25 IC6.5 | v68,125.8 68.3,126.1 70.3,126.1 70.72,126.52 70.72,128.36 70.85,128.49 v70.85,131.75
+5V  (via drill 0.35)  (3 unrouted)
  Top 0.838: 152.35,29.75 152.35,22 153.1,21.25 155.6,21.25 Q8.1 | 152.35,29.75 152.35,30.75 D16.C | 156.1,37.75 156.1,29.75 152.35,29.75 | 151.6,84.75 151.6,91.75 152.35,91.75 K11.1 | 151.6,84.75 151.6,79 R42.1 151.35,78.5 151.35,69 147.35,69 OK7.4 147.1,69.25 145.85,70.5 v144.6,70.5 140.35,74.75 137.1,74.75 135.35,76.5 132.6,76.5 132.35,76.75 | 151.6,84.75 140.35,84.75 133.35,91.75 K12.1 | 115.85,80.75 113.6,78.5 112.6,78.5 R38.1 112.35,78 111.35,77 108.85,77 v107.85,76 93.35,76 92.85,76.5 | 115.85,80.75 115.85,91.75 114.1,91.75 K13.1 | 132.35,76.75 132.35,78.25 R40.1 | 124.35,76.75 119.85,76.75 115.85,80.75 | 124.35,76.75 132.35,76.75 | v124.35,76.5 124.35,76.75 | 92.85,76.5 92.85,78.25 R36.1 | 85.6,76.5 74.85,76.5 73.1,78.25 R34.1 72.85,78 70.85,76 67.1,76 | 85.6,76.5 92.85,76.5 | 54.85,77 55.85,76 67.1,76 | 54.85,77 53.6,78.25 R32.1 | 35.1,77 35.35,76.75 47.35,76.75 | 35.1,77 33.6,78.5 R30.1 | 47.35,76.75 54.6,76.75 54.85,77 | 28.6,76.75 34.85,76.75 35.1,77 | 28.6,76.75 22.1,76.75 | 22.1,76.75 15.6,76.75 13.85,78.5 R63.1 | 28.6,76.75 v28.6,75.5 | v47.35,76.5 47.35,76.75 | v67.1,75.75 67.1,76 | v85.6,76.25 85.6,76.5 | v98.85,145.75 98.85,147.75 IC1(MCP2551).3 | 97.6,94 95.6,92 94.85,92 K14.1 | 97.6,94 v97.85,94.25 | 97.6,94 97.35,94.25 77.85,94.25 75.6,92 K15.1 76.35,93.25 67.35,93.25 65.35,95.25 57.6,95.25 55.6,93.25 K16.1 56.35,92 54.1,94.25 39.6,94.25 37.35,92 K17.1 36.85,92 36.6,92.25 28.85,92.25 25.85,89.25 22.1,89.25 | v36.85,19.5 36.1,20.25 33.85,20.25 C5.+ 33.35,20.5 32.1,20.5 32.1,24.25 D3.C 31.6,24.25 31.1,24.75 v28.35,24.75 | 22.1,89.25 20.85,89.25 18.35,91.75 K18.1 | 22.1,89.25 22.1,76.75
  Bottom 0.838: K12.1 133.35,91.75 133.35,85.75 133.6,85.5 D21.C 133.6,85 130.85,82.25 130.85,78.5 R47.1 | v144.6,70.5 144.6,69.5 143.85,68.75 OK8.4 143.6,68.25 142.6,67.25 142.6,62.75 150.35,55 150.35,43.5 155.85,38 | K11.1 152.35,91.75 152.35,86 D19.C 151.35,84.75 150.1,83.5 150.1,78.5 R44.1 | K13.1 113.85,91.75 113.85,85.75 113.35,85.25 D23.C 112.85,85 112.1,84.25 112.1,78.5 R50.1 | v124.35,76.5 124.35,68.75 OK9.4 | v107.85,76 107.85,71.75 105.1,69 OK10.4 | v28.6,75.5 28.6,68.5 OK14.4 | v47.35,76.5 47.35,68.75 OK13.4 | v67.1,75.75 67.1,68.75 OK12.4 | v85.6,76.25 85.6,68.75 OK11.4 | K17.1 37.1,91.75 37.1,85 D31.C 36.85,84.5 35.6,83.25 35.6,78 R61.1 | K16.1 56.35,91.75 56.35,85.5 D29.C 56.1,85 54.35,83.25 54.35,78.25 R59.1 | K15.1 75.35,91.75 75.35,86 74.85,85.5 D27.C 74.35,85 73.6,84.25 73.6,78.25 R57.1 | K14.1 94.6,91.75 94.6,85.75 94.1,85.25 D25.C 93.85,84.75 93.85,83.75 92.85,82.75 92.85,78.25 R52.1 | v98.85,145.75 100.1,144.5 100.1,96.5 v97.85,94.25 | v36.85,19.5 36.85,7.75 12---5V.1 | 15.85,60.5 10.6,60.5 8.1,63 8.1,68.5 8.85,69.25 OK16.4 | ESP1.VIN 13.85,149.25 11.35,146.75 11.35,99 18.1,92.25 K18.1 18.1,91.75 18.1,86.5 17.1,85.5 D2.C 16.85,85 15.6,83.75 15.6,79 R67.1 15.85,78.75 15.85,78.1 16.5,77.45 16.5,61.15 15.85,60.5 | v28.35,24.75 19.85,33.25 19.85,56.5 15.85,60.5
+12V  (via drill 0.35)  (9 unrouted)
  Top 0.838: 39.35,35.75 37.35,37.75 K2.1 | 39.35,35.75 41.6,33.5 | 41.6,33.5 42.85,32.25 52.1,32.25 53.35,31 D6.C | C1.1 23.35,14.75 23.35,17.75 C2.+ 22.85,17.75 22.2,18.4 v17.6,18.4 | 18.35,30.75 18.35,37.75 17.6,37.75 K1.1 17.35,38.25 17.35,47.5 16.85,47.5 15.85,48.5 15.85,70.75 | 18.35,30.75 18.35,30.25 17.85,29.75 15.6,29.75 14.6,30.75 D33.C | 18.35,30.75 34.35,30.75 D4.C 34.85,30.75 35.85,29.75 37.85,29.75 41.6,33.5 | 116.35,37.75 118.6,35.5 | 118.6,35.5 121.85,32.25 130.6,32.25 132.1,30.75 D14.C | 118.6,35.5 123.6,40.5 133.6,40.5 136.1,38 K7.1 | 113.35,30.75 112.85,31.25 103.6,31.25 101.85,33 | 101.6,33.25 97.1,37.75 96.6,37.75 | 101.6,33.25 101.85,33 | 93.85,30 94.1,29.75 98.1,29.75 101.6,33.25 | 93.85,30 93.1,30.75 D10.C | 93.85,30 93.6,29.75 74.6,29.75 73.6,30.75 D8.C 73.1,31.25 63.6,31.25 59.35,35.5 | 59.35,35.5 57.1,37.75 | 76.6,38 74.1,40.5 64.35,40.5 59.35,35.5 | 116.1,37.5 111.85,33.25 102.1,33.25 101.85,33 | 39.35,35.75 44.1,40.5 54.1,40.5 56.6,38 | 15.85,70.75 26.6,70.75 28.1,69.25 OK1.4 28.6,69 30.6,71 49.85,71 50.1,70.75 | 15.85,70.75 10.1,70.75 8.6,69.25 OK15.4 | 50.1,70.75 50.35,71 65.85,71 66.1,70.75 | 50.1,70.75 48.35,69 OK2.4 | 66.1,70.75 67.85,69 OK3.4 | 87.6,71 87.6,69 OK4.4 | 87.6,71 66.35,71 66.1,70.75 | 106.1,70.25 105.35,71 99.35,71 | 106.1,70.25 107.35,69 OK5.4 | 87.6,71 99.35,71 | OK6.4 127.35,69 127.35,70.5 106.35,70.5 106.1,70.25 | v101.1,126.25 92.6,126.25 90.85,128 IC6.8 | v99.35,71.25 99.35,71
  Bottom 0.838: 1---12V_SINDAL27.1 20.35,7.75 17.6,10.5 v17.6,18.4 | K1.1 17.6,37.75 17.6,26.1 19.2,24.5 19.2,20 v17.6,18.4 | v101.1,126.25 103.6,123.75 103.6,96.5 99.35,92.25 v99.35,71.25 | v17.6,18.4 9.3,18.4 IC7.1
ACELERADOR_APERTADO  (via drill 0.35)
  Top 0.61: v10.35,87.25 3.35,80.25 LED1.C | v10.35,121.5 10.85,122 22.35,122 23.85,123.5 ESP1.D4
  Bottom 0.61: v10.35,121.5 v10.35,87.25
ACELERADOR_PEDAL_AMARELO  (via drill 0.35)
  Top 0.61: v62.6,40.25 57.1,45.75 29.6,45.75 25.35,50 K2.O | 142.85,22.25 142.85,25.2 142.05,26 v64.35,26
  Bottom 0.61: 64.1,26 64.1,35.75 62.6,37.25 v62.6,40.25 | 64.1,26 64.1,7.75 30---K2E_NF.1 | v64.35,26 64.1,26
ACELERADOR_VEICULO_VERMELHO  (via drill 0.35)
  Top 0.61: v62.85,24 58.1,28.75 v33.6,28.75
  Bottom 0.61: v62.85,24 62.85,7.75 29---K2E_C.1 | v33.6,28.75 31.35,31 31.35,35.75 K2.P
BOTAO_CAMBIO_FRENTE  (via drill 0.35)  (1 unrouted)
  Top 0.61: v79.35,23.5 v75.85,20 | v107.85,15 v76.85,15
  Bottom 0.61: v75.85,20 75.85,12.25 75.1,11.5 75.1,7.75 37---K5E_NF.1 | v79.35,23.5 86.1,30.25 86.1,48.75 84.85,50 K5.O | v76.85,15 76.85,9.5 76.6,9.25 76.6,7.75 38---K6E_C.1 | v107.85,15 108.85,16 108.85,34.25 110.35,35.75 K6.P
CANH  (via drill 0.35)
  Top 0.61: 152.1,218.5 152.1,215.5 152.6,215 152.6,189 151.6,188 151.6,184.5 IC15.7 | 152.1,218.5 153.6,220 154.6,220 154.6,221.5 IC14.7 | 152.1,218.5 v152.1,224.5
  Bottom 0.61: v152.1,224.5 140.1,236.5 114.1,236.5 111.6,234 101.6,234 101.6,231 CANH.1
CANL  (via drill 0.35)
  Top 0.61: v153.6,214.5 153.6,185.5 152.6,184.5 IC15.6 | v157.1,218 156.1,219 156.1,221.5 IC14.6
  Bottom 0.61: v153.6,214.5 v157.1,218 139.6,235.5 114.6,235.5 112.1,233 104.6,233 103.6,232 103.6,231 CANL.1
CENTRAL_BOTAO_CAMBIO  (via drill 0.35)
  Top 0.61: 123.35,21.75 123.6,21.5 125.35,21.5 126.1,20.75 126.1,14 122.1,14 121.35,14.75 121.35,16 121.85,16 122.85,17 | 123.85,17 122.85,17 | v67.85,47.75 47.35,47.75 45.1,50 K3.O | v68.1,19 121.1,19 122.85,17.25 122.85,17
  Bottom 0.61: v67.85,47.75 67.85,19 | 67.85,19 67.85,8.25 67.35,7.75 32---K3E_NF.1 | v68.1,19 67.85,19
COMUM_CAMBIO  (via drill 0.35)  (1 unrouted)
  Top 0.61: v65.6,27 57.1,35.5 51.35,35.5 51.1,35.75 K3.P | 113.85,47.75 98.85,47.75 96.6,50 K5.S 96.35,50 94.1,47.75 79.1,47.75 76.85,50 | 116.1,50 113.85,47.75 | 136.1,50 127.1,50 124.85,47.75 113.85,47.75
  Bottom 0.61: v65.6,27 65.6,7.75 31---K3E_C.1
FAST_WIPER_RELAY  (via drill 0.35)
  Top 0.61: v131.1,97.25 v140.1,88.25 | v125.1,103.25 120.9,107.45 76.9,107.45 v76.6,107.75 | IC5.6 66.85,118.25 66.85,119.32 66.93,119.4 66.93,120.4 66.96,120.38 70.88,120.38 72.8,118.45 v73.7,118.45
  Bottom 0.61: v140.1,88.25 140.1,80.25 140.6,79.75 LED9.C | v125.1,103.25 v131.1,97.25 | v76.6,107.75 75.55,106.7 73.8,106.7 73.7,106.8 v73.7,118.45
FRENTE  (via drill 0.35)
  Top 0.61: v31.85,84.75 48.35,84.75 49.6,83.5 75.6,83.5 75.6,79.25 75.35,79 75.35,78.5 76.35,77.5 80.35,77.5 82.6,79.75 LED5.C
  Bottom 0.61: v31.85,84.75 29.6,87 29.6,121.5 31.6,123.5 ESP1.D5
GEAR_NEUTRAL  (via drill 0.35)
  Top 0.61: v122.1,86.25 122.1,80 | v45.85,109.75 45.95,109.65 v113.35,109.65
  Bottom 0.61: v122.1,86.25 118.85,89.5 118.85,104.15 v113.35,109.65 | v45.85,109.75 36.85,118.75 36.85,123.5 ESP1.D19
GND  (via drill 0.35)  (206 unrouted)
  Top 0.838: R5.2 162.17,17.53 v161.9,17.8 | Q18.2 7.9,64.95 7.9,64.7 | Q2.2 47.45,64.05 45.5,62.1 v45.5,60.7 | Q1.2 26,62.74 v26,61.7 | v89.4,66.6 89.7,66.9 89.9,66.9 | v104.8,66.5 105.4,66.5 105.8,66.1 | R54.2 163.45,67.55 163.5,67.5 163.5,65.9 v163,65.4 | R84.1 139.57,140.5 v137.7,140.5 | R71.1 v122.81,150.59 v122.8,150.6 | v114.7,137.5 112.32,137.5 C27.2 111.6,138 111.6,135 IC11.13 | R74.1 113.4,146.36 113.4,147.3 v110.7,147.3 | v134.8,123.4 133.64,122.24 C26.2 | IC10.13 112.32,120.29 C24.2 | R25.1 74.55,144.9 73.8,144.9 v73,144.1 | v69.3,130.8 69.7,130.4 v74.7,130.4 | v75,125.7 75.6,125.7 76,125.3 76.6,125.3 77.1,124.8 78.31,124.8 R82.1 | v63.3,122.2 63.1,122.4 58.2,122.4 57.3,123.3 v56.8,123.3 | C10.2 61.93,127.57 v62.8,126.7 | v75.1,108.3 74.9,108.1 73.9,108.1 | C9.2 62.09,142.81 61.4,143.5 59.5,143.5 | v70.8,139.9 70.39,140.31 65.1,140.31 | 65.1,140.31 63.6,140.31 62.99,139.7 IC4.14 | IC4.12 65.53,139.88 65.1,140.31 | v128.6,66 129.1,65.5 130.1,65.5 v133.6,62 | v146.1,64.5 148.1,64.5 Q7.2 | v122.7,11.6 122.3,11.6 v121.8,12.1
  Bottom 0.838: v72.3,52 72.3,55.1 77.6,60.4 v77.6,63.3 | v89.4,66.6 89.4,66.1 | Q13.2 109.7,65.58 109.7,65.9 109.6,66 109.6,66.2 109.4,66.4 v109.4,67.4 | v74.7,130.4 75,130.1 v75,125.7 | v62.8,126.7 63,126.5 63,126 | v75.1,108.3 75.4,108.6 75.4,109 | v128.6,66 128.6,64 Q11.2 | v133.6,62 133.69,61.91 | v146.1,64.5 146.1,65.5 146.6,66 148.1,66 149.1,65 Q9.2 | 133.6,26 133.56,26.15
  other vias: 162.2,24.5 162.2,27.9 126.4,11.7 133.1,17.6 138.3,15.2 128.6,7.2 132.3,7.3 114.7,16.7 113.5,20.7 41.8,16.7 45.8,16.7 41.6,10.3 31.6,12.6 21.6,20.6 21,14.1 13.5,27 20.7,26.8 16.9,22.8 6.7,43.8 13.4,43.9 6.2,59.7 12.7,57.7 55.2,69.2 35.8,73.6 54.1,60.7 36,62.3 31.9,66.1 50.9,66.1 29.5,48.7 30.2,42.1 23.9,44.1 23,52.8 44.8,53.7 55.3,54.1 74.2,73.4 92,61.8 73.9,63.4 90.9,52.9 93,69.4 98.5,68.5 102.1,64.2 117.9,62.2 121,57.1 131.5,55 131,45.3 145.1,56.4 147,60.5 152.4,60 154.1,44.4 162.6,50.3 155.2,25.7 146.2,24.7 149.7,29.9 162.2,108.4 162,101.1 162.6,92.5 148,103.9 152,99.6 144.5,96.4 144.4,100.3 149.1,88.1 145.9,82.5 129.5,86.8 129,102.4 151.5,144.5 155,141.8 129.1,152.8 147.5,138.1 143.7,119.9 146.7,114.6 97.3,133.3 114.7,141.4 106.1,149.4 122.3,121.3 122.5,113.1 116.7,111.4 120.4,130.7 121.8,136.9 115.9,122.3 108.4,118.4 97.8,123.3 101.6,122.9 101.9,115.9 17.8,116.7 17,132.4 23,138.5 26.1,152.9 56,146.8 63.7,156 74.1,156.6 78.3,151.9 85.7,149 71.9,152.2 88.4,142.7 96.3,141.5 70.4,146.1 83.3,156.2 56.2,141.7 75.5,120.8 75.8,117.5 83.1,121.2 55.8,108.2 64.4,108.1 47.5,21.1 27,117.6 24.3,113.7 122,19.8 133.2,16 135.8,20.3
  pour Top (isolate 0.813): -0.7,163.5 -0.7,3.1 197.7,3.1 197.7,163.5
  pour Bottom (isolate 0.813): -0.7,163.5 -0.7,3.2 197.5,3.2 197.5,163.5
HIGH_BEAM_RELAY  (via drill 0.35)
  Top 0.61: v58.35,94.25 v63.6,89 | v58.35,118.25 59.85,119.75 60.85,119.75 61.35,119.25 61.35,118.25 IC5.2
  Bottom 0.61: LED13.C 63.6,80.25 v63.6,89 | v58.35,118.25 v58.35,94.25
HIGH_BEAM_SIGNAL  (via drill 0.35)
  Top 0.61: v74.1,90.25 v78.6,85.75 | v43.35,19.5 46.85,23 76.85,23 v78.85,25 79.1,25 82.1,22 99.1,22 v100.1,21 | v102.1,9 103.6,9 103.6,7.75 56---K5N_NA.1
  Bottom 0.61: 78.6,65.25 77.6,65.25 R24.2 | v78.6,85.75 78.6,65.25 | v74.1,90.25 74.1,102.75 75.35,104 K15.S | v43.35,19.5 43.35,7.75 16---HIGH_BEAM.1 | v78.85,25 78.85,65.25 78.6,65.25 | v102.1,9 100.1,11 v100.1,21
HORN_SIGNAL  (via drill 0.35)
  Top 0.61: v94.6,13 v49.35,13 | v114.6,65.25 110.1,60.75 100.6,60.75 v93.85,67.5
  Bottom 0.61: K13.S 114.1,104 116.85,101.25 116.85,89.25 117.1,89 117.1,65.5 116.1,65.5 R20.2 115.85,65.25 v114.6,65.25 | v49.35,13 49.35,11.5 46.35,8.5 46.35,7.75 18---HORN.1 | 50---K3N_NA.1 94.6,7.75 v94.6,13 94.6,29 98.1,32.5 98.1,43.5 93.85,47.75 v93.85,67.5
IBT2_SIGNAL1  (via drill 0.35)
  Top 0.61: v123.35,23.5 115.4,23.5 114.85,22.95 114.85,22 | v122.1,52.25 117.6,56.75 27.55,56.75 23.05,61.25 v22.5,61.25
  Bottom 0.61: v123.35,23.5 122.1,24.75 v122.1,52.25 | v22.5,61.25 22.5,119.4 26.6,123.5 ESP1.D16
IBT2_SIGNAL2  (via drill 0.35)
  Top 0.61: v61.6,80 62.6,80 | v62.35,119.75 61.6,120.5 61.18,120.5 61.17,120.51 53.89,120.51 52.65,121.75 31.1,121.75 29.35,123.5 ESP1.D17
  Bottom 0.61: v61.6,80 61.6,114.5 62.35,115.25 v62.35,119.75
INPUT_MANUAL/AUTO  (via drill 0.35)
  Top 0.61: D18.A 159.85,62.75 147.35,50.25 144.1,50.25 K8.O 143.85,50 135.6,41.75 93.35,41.75 v88.1,36.5 | v88.1,25 v84.35,25
  Bottom 0.61: v84.35,25 84.35,8 84.1,7.75 43---K8E_NF.1 | v88.1,36.5 v88.1,25
LED_AZUL  (1 unrouted)
  Bottom 0.61: 85.35,6.5 50.1,6.5 49.35,7.25 49.35,7.5 20---FAST_WINDSHIELD_WIPER.1 | 85.35,7.5 85.35,6.5 | R12.2 154.6,65.5 155.6,66.5 155.6,101 152.6,104 K11.S 152.35,104.25 152.35,106.5 140.1,106.5 139.1,105.5 139.1,28.75 130.35,20 130.35,5.5 89.35,5.5 88.35,6.5 85.35,6.5
LED_VERDE  (via drill 0.35)  (2 unrouted)
  Top 0.61: 90.1,7.75 88.85,9 47.85,9 47.85,7.75 19---SLOW_WINDSHIELD_WIPER.1 | v127.85,49 121.6,42.75 v97.1,42.75
  Bottom 0.61: K12.S 133.35,104 133.35,103 134.85,101.5 134.85,73.25 136.35,71.75 136.35,65.25 135.35,65.25 R16.2 135.1,65 127.85,57.75 v127.85,49 | v97.1,42.75 92.6,38.25 92.6,10.25 90.1,7.75
LEFT_TURN_RELAY  (via drill 0.35)
  Top 0.61: v26.85,112.75 26.85,113.85 20.2,120.5 9.6,120.5 8.85,121.25 8.85,126.75 59.85,126.75 61.35,125.25 61.35,124.25 IC5.15
  Bottom 0.61: v26.85,112.75 26.85,80.5 25.85,79.5 LED15.C
LEFT_TURN_SIGNAL
  Top 0.61: 62---K7N_NA.1 112.6,7.5 112.6,6.5 41.1,6.5 40.1,7.5 14---LEFT_TURN_LIGHT.1
  Bottom 0.61: 40.1,65.5 39.1,65.5 R28.2 | 40.1,65.5 40.1,101.25 37.35,104 K17.S | 40.1,65.5 40.1,7.75 14---LEFT_TURN_LIGHT.1
LOW_BEAM_RELAY  (via drill 0.35)
  Top 0.61: v78.6,93 v81.6,90 | IC5.3 63.1,118.25 63.1,119.25 63.52,119.67 64.38,119.67 66,121.3 71.35,121.3 73.3,119.35 v78.7,119.35
  Bottom 0.61: v81.6,90 81.6,80.75 82.6,79.75 LED12.C | v78.7,119.35 78.7,93.1 v78.6,93
LOW_BEAM_SIGNAL  (via drill 0.35)
  Top 0.61: v98.85,16 v49.35,16 | v92.1,83.5 94.85,80.75 v94.85,77
  Bottom 0.61: 99.1,16 99.1,7.75 53---K4N_NA.1 | 99.1,16 99.1,62 96.85,64.25 R22.2 96.6,64.25 94.85,66 v94.85,77 | v49.35,16 44.85,11.5 44.85,7.75 17---LOW_BEAM.1 | v98.85,16 99.1,16 | v92.1,83.5 92.1,101.5 94.6,104 K14.S
M/A  (via drill 0.35)
  Top 0.61: v82.85,23 83.85,24 v101.35,24 | v104.35,27 106.85,29.5 143.6,29.5 149.85,35.75 K8.P
  Bottom 0.61: v82.85,23 82.85,8 82.6,7.75 42---K8E_C.1 | v104.35,27 v101.35,24
MANUAL/AUTO  (via drill 0.35)
  Top 0.61: 41.1,80.75 24.1,80.75 23.35,80 LED2.C | 41.1,80.75 41.85,80 42.85,80 LED3.C | v41.1,81 41.1,80.75
  Bottom 0.61: v41.1,81 41.1,103.75 49.1,111.75 49.1,123.25 49.35,123.5 ESP1.D23
N$1
  Top 0.61: IC6.7 93.6,128.25 95.85,128.25 IC6.6
N$2  (via drill 0.35)
  Top 0.61: v53.85,113.85 79.45,113.85 87.6,122 94.6,122 95.85,120.75 IC6.3 | v52.6,137.5 42.1,148 33.1,148 31.85,149.25 ESP1.D25
  Bottom 0.61: v52.6,137.5 52.6,117.5 53.85,116.25 v53.85,113.85
N$3  (via drill 0.35)
  Top 0.61: R7.S 149.35,13.5 131.85,13.5 130.35,15 R8.1 130.35,15.25 v128.35,17.25 | v96.85,113.75 98.95,111.65 v110.5,111.65
  Bottom 0.61: v96.85,113.75 96.85,117.25 93.6,120.5 IC6.2 | v128.35,17.25 121.1,24.5 121.1,52.5 122.6,54 122.6,79.25 124.1,80.75 124.1,104.15 121.42,106.83 118.27,106.83 113.45,111.65 v110.5,111.65
N$5  (via drill 0.35)
  Top 0.61: v76.85,32 80.35,35.5 90.1,35.5 90.35,35.75 K5.P
  Bottom 0.61: v76.85,32 74.85,30 74.85,12.5 73.6,11.25 73.6,7.75 36---K5E_C.1
N$6  (via drill 0.35)
  Top 0.61: v96.1,145.75 96.1,147.75 IC1(MCP2551).1 | v87.85,121 79.6,112.75 v48.1,112.75
  Bottom 0.61: v96.1,145.75 87.85,137.5 v87.85,121 | v48.1,112.75 39.35,121.5 39.35,123.5 ESP1.D21
N$7  (1 unrouted)
  Top 0.61: R66.1 162.1,21.25 158.6,21.25 Q8.3
N$8
  Top 0.61: R2.2 81.6,150.75 83.85,153 96.1,153 IC1(MCP2551).8
N$9
  Bottom 0.61: R44.2 151.6,78.25 153.85,80.5 153.85,93.5 153.1,94.25 143.85,94.25 143.85,78.25 OK8.1
N$10  (via drill 0.35)
  Top 0.61: v92.1,154 79.2,154 74.8,158.4 57.4,158.4 55.5,156.5 13.1,156.5 13.1,153.75 13.6,153.25 14.85,153.25 14.85,154.25 R3.2 | v99.85,146.25 99.85,147.75 IC1(MCP2551).4
  Bottom 0.61: v99.85,146.25 v92.1,154
N$11
  Top 0.61: JP1.2 162.1,133.5 160.1,133.5 160.1,150.25 155.6,154.75 113.1,154.75 110.1,151.75 97.6,151.75 97.6,153 IC1(MCP2551).7 97.35,153.25 97.35,153.75 91.9,159.2 14.55,159.2 11.85,156.5 1.1,156.5 1.1,15.75 6.85,10 24.85,10 24.85,7.75 4---CAN_H.1
N$12  (via drill 0.35)
  Top 0.61: v13.6,23 14.12,22.48 GND.A
  Bottom 0.61: IC7.2 8.14,22.2 8.74,22.8 13.4,22.8 v13.6,23
N$14  (via drill 0.35)
  Top 0.61: IC3.6 66.6,146.25 67.85,146.25 IC3.7 67.25,145.65 v67.25,144.8 | v66.85,127.5 66.85,124.25 IC5.11 | 67.35,132.5 v67.35,130.75 65.35,130.75 64.6,130 54.85,130 v50.6,134.25 | 67.35,132.5 66.85,132.5 IC4.6 | IC4.7 67.85,132.5 67.35,132.5
  Bottom 0.61: v66.85,127.5 67.35,128 v67.35,130.75 67.35,131 68.35,132 68.35,144.8 v67.25,144.8 | v50.6,134.25 50.6,135.5 36.85,149.25 ESP1.D32
N$15  (via drill 0.35)
  Top 0.61: R3.1 14.1,154.5 14.1,155.5 32.1,155.5 33.35,154.25 R4.2 46.85,154.25 v49.1,152
  Bottom 0.61: v49.1,152 51.6,149.5 51.6,134 50.6,133 50.6,127.25 47.1,123.75 ESP1.D22
N$16
  Top 0.61: 113.1,222 117.1,222 R70.2 | 113.1,222 113.1,219.5 D1.C | 113.1,222 113.1,228.5 Q20.2
  Bottom 0.61: Q21.3 123.6,226.5 121.6,228.5 113.6,228.5 Q20.2
N$17  (via drill 0.35)
  Top 0.838: D4.A 37.1,31 34.85,33.25 29.85,33.25 25.35,37.75 K2.2 | v28.85,60.5 28.85,62.25 Q1.3
  Bottom 0.838: v28.85,60.5 26.85,58.5 26.85,39.5 25.35,38 K2.2
N$18  (via drill 0.35)
  Top 0.838: 23.1,25.25 23.1,23 C7.+ | 23.1,25.25 23.1,26.25 C6.1 | 23.1,25.25 25.1,25.25 25.6,25.75 34.35,25.75 35.6,24.5 D3.A | 22.85,23.25 C7.+ | v14.9,25 14.95,24.95 21.02,24.95 C7.+
  Bottom 0.838: IC7.3 14.54,24.64 v14.9,25
N$19
  Top 0.61: R55.1 158.85,67.25 158.85,63.75 161.85,63.75 162.6,63 D18.C
N$20  (via drill 0.35)
  Top 0.61: v118.85,44.75 116.85,46.75 35.05,46.75 19.6,62.2 v19.6,64.75
  Bottom 0.61: v118.85,44.75 118.85,9.25 117.35,7.75 65---K8N_NA.1 | v19.6,64.75 19.6,102.75 18.35,104 K18.S
N$21
  Top 0.61: R73.1 132.1,150.5 132.6,150 153.6,150 154.1,150.5 155.85,150.5 POTENCIOMETRO.3
N$22  (1 unrouted)
N$23  (via drill 0.35)
  Top 0.61: v141.1,77 141.35,76.75 v144.85,76.75
  Bottom 0.61: v141.1,77 141.1,77.75 140.85,78 LED9.A | v144.85,76.75 146.1,78 OK8.2
N$24
  Bottom 0.61: R43.2 143.6,64.5 146.1,67 146.1,68.5 OK8.3
N$25
  Bottom 0.61: R43.1 143.6,63.5 147.35,63.5 147.35,64.5 Q9.1
N$26  (via drill 0.35)
  Top 0.838: D16.A 154.85,31 154.85,35.75 153.1,35.75 150.35,38.5 144.6,38.5 144.1,38 K8.2 | v149.35,53.5 149.35,62 Q7.3
  Bottom 0.838: v149.35,53.5 145.6,49.75 145.6,39.5 144.1,38 K8.2
N$27  (via drill 0.35)
  Top 0.61: v80.1,129 81.85,127.25 R6.2 81.85,127 82.6,126.25 v88.85,126.25 | v79.6,140.5 77.9,142.2 64.7,142.2 62.15,144.75 51.6,144.75 47.1,149.25 ESP1.D36 | v156.35,18.25 157.85,18.25 159.65,16.45 R5.1 | v141.35,69.25 135.6,75 v98.35,75
  Bottom 0.61: v80.1,129 79.6,129.5 v79.6,140.5 | v156.35,18.25 141.35,33.25 v141.35,69.25 | v98.35,75 96.85,76.5 96.85,112.25 88.85,120.25 v88.85,126.25
N$28  (1 unrouted)
N$31
  Top 0.61: R63.2 12.1,78.5 8.6,78.5 OK15.1
N$32  (via drill 0.35)
  Top 0.61: v38.35,68.25 36.6,70 v32.85,70 | v32.85,112.75 34.85,114.75 v59.35,114.75 79.1,114.75 85.85,121.5 85.85,123.25 84.35,123.25 R27.2 | v59.6,147.75 61.35,147.75 61.35,146.5 IC3.2
  Bottom 0.61: v38.35,68.25 38.35,67.75 38.85,67.25 R28.1 | v32.85,112.75 v32.85,70 | v59.6,147.75 59.35,147.5 v59.35,114.75
N$33  (via drill 0.35)  (2 unrouted)
  Top 0.61: v73.1,12 v85.6,12 | v73.6,17 113.1,17 116.6,13.5 121.1,13.5 121.6,13 126.6,13 127.1,13.5 127.1,18.5 v140.6,18.5 | v154.6,95.5 v160.6,89.5 | v150.6,95.5 150.6,90 146.6,90 K11.P
  Bottom 0.61: 87.1,8 85.6,9.5 v85.6,12 | v73.1,12 73.6,12.5 v73.6,17 | v140.6,18.5 150.6,18.5 150.6,10.5 151.6,9.5 164.6,9.5 164.6,85.5 v160.6,89.5 | v150.6,95.5 v154.6,95.5
N$34
  Top 0.61: LED1.A 3.35,78.5 5.85,78.5 OK15.2
N$36
  Top 0.61: R62.2 5.85,67.25 5.85,69 OK15.3
N$37  (via drill 0.35)
  Top 0.61: v95.6,27 93.85,28.75 v83.35,28.75 | v83.6,85.5 103.6,85.5 107.85,89.75 K13.P
  Bottom 0.61: v95.6,27 95.6,8.25 96.1,7.75 51---K3N_C.1 | v83.35,28.75 81.6,30.5 81.6,71.75 83.6,73.75 v83.6,85.5
N$38
  Top 0.61: R62.1 6.7,66.05 7.45,66.8 7.9,66.8 8.1,67 9.35,67 10.6,65.75 Q18.1
N$39  (via drill 0.35)
  Top 0.61: v90.1,9 100.6,9 100.6,7.75 54---K4N_C.1 | v80.6,27 v85.35,27 | v79.85,78.5 84.85,83.5 v86.6,83.5
  Bottom 0.61: v90.1,9 85.35,13.75 v85.35,27 | v80.6,27 79.85,27.75 v79.85,78.5 | v86.6,83.5 88.6,85.5 88.6,89.75 K14.P
N$40  (via drill 0.35)
  Top 0.61: 65.35,124 IC5.12 65.4,121.8 64.4,120.8 62.38,120.8 61.9,121.27 56.03,121.27 v55.65,121.65
  Bottom 0.61: v55.65,121.65 53.6,123.7 53.6,148.75 49.35,153 34.35,153 34.35,149.5 ESP1.D33
N$41
  Top 0.838: 9.6,38.5 6.1,38.5 5.6,38 K1.2 | 9.6,38.5 12.1,38.5 15.35,35.25 17.1,35.25 17.1,31 D33.A | 9.6,38.5 9.6,63.25 Q18.3
N$42  (via drill 0.35)
  Top 0.61: v59.6,79.25 61.85,81.5 v64.6,81.5 | IC3.3 62.85,146.25 62.85,145.25 v64.35,143.75 64.6,143.75 65.35,143 74.35,143 R25.2
  Bottom 0.61: v59.6,79.25 59.6,67.75 58.6,66.75 R26.1 | v64.6,81.5 67.85,84.75 67.85,123.75 64.45,127.15 64.45,129.8 64.89,130.24 64.89,143.21 v64.35,143.75
N$43  (via drill 0.35)
  Top 0.61: v95.6,44.75 v102.85,44.75 | v83.6,61 74.6,70 v71.1,70
  Bottom 0.61: v102.85,44.75 102.85,34 105.35,31.5 105.35,7.75 57---K5N_C.1 | v95.6,44.75 88.1,52.25 88.1,56.5 v83.6,61 | v71.1,70 70.85,70.25 70.85,84.75 69.85,85.75 69.85,89.75 K15.P
N$44  (via drill 0.35)
  Top 0.61: v65.35,129.5 65.55,129.3 v76.7,129.3 | v65.35,144.25 64.1,145.5 64.1,146.25 IC3.4 64.1,146.5 64.35,146.5 64.35,148.25 63.6,149 56.35,149 56.35,152.75 R23.2
  Bottom 0.61: v65.35,144.25 65.65,143.95 65.65,129.8 v65.35,129.5 | R24.1 77.6,66.75 77.6,122.4 76.7,123.3 v76.7,129.3
N$45  (via drill 0.35)
  Top 0.61: v59.6,18 59.1,18.5 32.85,18.5 v26.6,24.75
  Bottom 0.61: v59.6,18 59.6,7.75 27---K1E_NA.1 | v26.6,24.75 18.85,32.5 18.85,48.75 17.6,50 K1.S
N$46  (via drill 0.35)
  Top 0.61: v79.35,147.75 65.85,147.75 65.6,147.5 65.35,147.5 65.35,146.5 IC3.5 | v95.6,86.5 v91.1,91
  Bottom 0.61: R22.1 96.6,66 96.1,66.5 96.1,72.5 R21.2 95.85,72.75 95.85,86.25 v95.6,86.5 | v79.35,147.75 86.85,140.25 86.85,97.5 91.1,93.25 v91.1,91
N$47  (via drill 0.35)  (1 unrouted)
  Top 0.61: v63.35,137 64.1,137 64.1,138.5 IC4.13 | v63.35,135 60.85,135 60.6,135.25 v30.6,135.25
  Bottom 0.61: v63.35,135 v63.35,137 | 19.1,123.75 v30.6,135.25
N$48  (via drill 0.35)
  Top 0.61: v83.6,128.25 87.1,131.75 R10.2 | v81.6,118.5 78.85,115.75 v60.35,115.75 v52.35,115.75 | v61.1,131 61.6,131.5 61.6,132.5 IC4.2 | v42.1,81 44.85,83.75 v48.1,83.75
  Bottom 0.61: v83.6,128.25 81.6,126.25 v81.6,118.5 | v60.35,115.75 60.35,130.25 v61.1,131 | v42.1,81 42.1,36.5 50.35,28.25 50.35,8 50.6,7.75 21---RIGHT_FRONT_DOOR.1 | v48.1,83.75 52.35,88 v52.35,115.75
N$49  (via drill 0.35)
  Top 0.61: v62.35,131 62.85,131.5 62.85,132.5 IC4.3 | R11.2 81.6,131.75 78.25,128.4 64.9,128.4 64.3,129 v62.35,129 52.85,129 v51.6,127.75 | v42.85,101.25 43.1,101.5 v47.85,101.5
  Bottom 0.61: v62.35,131 v62.35,129 | v42.85,101.25 42.85,90.5 43.1,90.25 43.1,36.75 51.85,28 51.85,8 52.1,7.75 22---LEFT_FRONT_DOOR.1 | v47.85,101.5 50.35,104 50.35,122.25 51.6,123.5 v51.6,127.75
N$50  (via drill 0.35)
  Top 0.61: v72.35,131.75 76.35,131.75 R13.2 | v69.35,135.75 66.6,135.75 64.35,133.5 64.35,132.75 IC4.4 | v45.85,95.25 46.85,96.25 v68.85,96.25
  Bottom 0.61: v69.35,135.75 69.35,134.75 v72.35,131.75 72.35,128.75 71.6,128 71.6,99 v68.85,96.25 | v45.85,95.25 45.85,64 53.35,56.5 53.35,8 53.6,7.75 23---RIGHT_REAR_DOOR.1
N$51  (via drill 0.35)
  Top 0.61: 73.47,135.38 72.85,134.75 66.85,134.75 65.6,133.5 65.6,132.75 IC4.5 | 73.47,135.38 75.85,137.75 R15.2 | v55.6,51.75 57.35,53.5 v67.85,53.5 | v80.6,83 v76.35,78.75 | v82.85,134.5 82.1,135.25 73.6,135.25 73.47,135.38
  Bottom 0.61: v55.6,51.75 55.6,8 55.35,7.75 24---LEFT_REAR_DOOR.1 | v67.85,53.5 76.35,62 v76.35,78.75 | v80.6,83 80.6,126.75 82.85,129 v82.85,134.5
N$52  (via drill 0.35)
  Top 0.61: v60.35,134.25 60.35,132.75 IC4.1 | v63.35,150.75 63.85,151.25 63.85,152.25 IC3.13
  Bottom 0.61: v60.35,134.25 61.35,135.25 61.35,148.75 v63.35,150.75
N$53  (via drill 0.35)
  Top 0.61: v111.85,53.5 110.85,54.5 v65.85,54.5 | v62.6,85.5 58.6,89.5 50.85,89.5 50.6,89.75 K16.P
  Bottom 0.61: v111.85,53.5 111.85,34.25 109.85,32.25 109.85,7.75 60---K6N_C.1 | v65.85,54.5 62.6,57.75 v62.6,85.5
N$54  (via drill 0.35)
  Top 0.61: v114.6,71.5 113.35,72.75 v81.35,72.75 | v78.6,146 79.1,145.5 81.35,145.5 R18.2 | v73.85,150.5 68.1,150.5 68.1,152.25 IC3.10
  Bottom 0.61: v114.6,71.5 114.6,68.5 115.85,67.25 R20.1 | v81.35,72.75 80.85,73.25 80.85,80.5 79.6,81.75 79.6,126.75 78.6,127.75 v78.6,146 78.35,146 v73.85,150.5
N$55  (via drill 0.35)
  Top 0.838: v147.35,85.75 146.6,85.75 140.6,91.75 K11.2
  Bottom 0.838: 148.35,84.75 148.6,85 D19.A | 148.35,84.75 148.35,67.75 150.6,65.5 150.6,63.75 149.35,62.5 148.6,62.5 Q9.3 | 148.35,84.75 v147.35,85.75
N$56  (via drill 0.35)
  Top 0.61: v132.6,67 125.6,74 v109.85,74 | v101.1,143 99.35,144.75 83.85,144.75 79.6,149 75.85,149 R14.2 75.6,149.25 66.6,149.25 IC3.11
  Bottom 0.61: v132.6,67 135.1,67 R16.1 | v109.85,74 108.85,75 108.85,86 104.6,90.25 104.6,139.5 v101.1,143
N$57  (via drill 0.35)
  Top 0.61: v103.35,13 114.1,13 114.1,7.75 63---K7N_C.1 | v101.35,11 62.35,11 61.35,12 v39.1,12 | v38.35,85.75 34.35,89.75 31.35,89.75 K17.P
  Bottom 0.61: v101.35,11 v103.35,13 | v39.1,12 39.1,63.5 37.35,65.25 37.35,76.25 38.35,77.25 v38.35,85.75
N$58  (via drill 0.35)
  Top 0.61: v149.35,72.25 145.85,75.75 137.35,75.75 125.85,87.25 121.6,87.25 112.6,96.25 v86.85,96.25 | v70.6,155.25 67.85,155.25 66.85,156.25 R9.2 | v65.6,150.75 65.35,150.75 65.35,152.25 IC3.12
  Bottom 0.61: v149.35,72.25 154.35,67.25 R12.1 | v86.85,96.25 85.85,97.25 85.85,140 75.32,150.53 75.32,152.07 72.15,155.25 v70.6,155.25 70.1,155.25 v65.6,150.75
N$60  (via drill 0.35)
  Top 0.61: v131.85,79.75 131.6,80 v125.85,80
  Bottom 0.61: v131.85,79.75 131.85,79.25 132.6,78.5 R47.2 | v125.85,80 124.35,78.5 OK9.1
N$61
  Top 0.61: R30.2 31.6,78.5 28.35,78.5 OK1.1
N$62  (via drill 0.35)
  Top 0.61: v125.35,73 v121.6,73
  Bottom 0.61: v121.6,73 121.6,78.25 LED10.A | v125.35,73 126.6,74.25 126.6,78.25 OK9.2
N$63
  Bottom 0.61: R46.2 123.85,62.75 125.6,64.5 125.6,67.75 126.6,68.75 OK9.3
N$64
  Top 0.61: LED2.A 25.6,78.5 OK1.2
N$65
  Top 0.61: R29.2 25.85,66.25 25.85,69 OK1.3